# Altium schematic sheet Adapter_2023-02-26.schdoc
size 134 x 122 mm
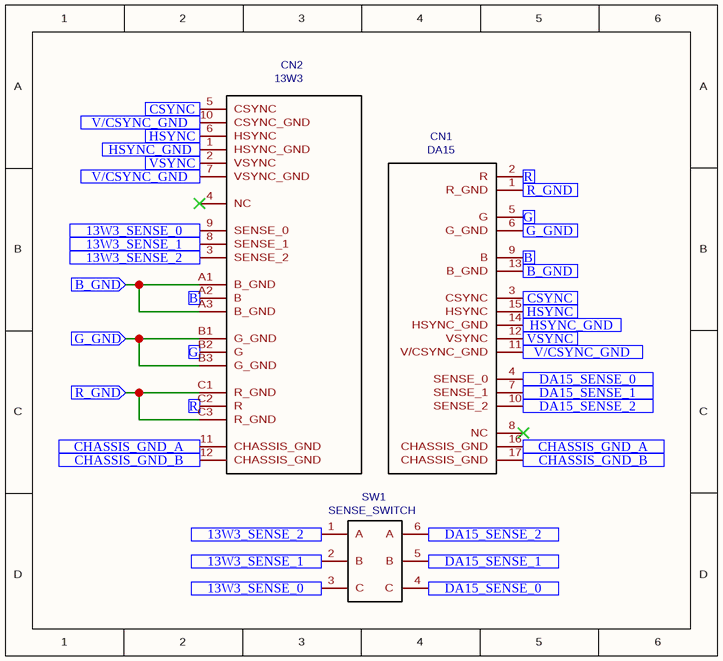
[diagram p0: Adapter_2023-02-26.schdoc]

## Parts
CN1  DA15  [DA15_RIGHT_ANGLE_PCB_MOUNT]
CN2  13W3  [13W3_RIGHT_ANGLE_PCB_MOUNT]
SW1  SENSE_SWITCH  [DIP_SWITCH_3POS]

## Ports
13W3_SENSE_0 (in), 13W3_SENSE_1 (in), 13W3_SENSE_2 (in), B (in), B_GND (in), CHASSIS_GND_A (in), CHASSIS_GND_B (in), CSYNC (in), DA15_SENSE_0 (in), DA15_SENSE_1 (in), DA15_SENSE_2 (in), G (in), G_GND (in), HSYNC (in), HSYNC_GND (in), R (in), R_GND (in), V/CSYNC_GND (in), VSYNC (in)

## Nets
13W3_SENSE_0: CN2.9(SENSE_0) SW1.3(C) ; port 13W3_SENSE_0
13W3_SENSE_1: CN2.8(SENSE_1) SW1.2(B) ; port 13W3_SENSE_1
13W3_SENSE_2: CN2.3(SENSE_2) SW1.1(A) ; port 13W3_SENSE_2
B: CN1.9(B) CN2.A2(B) ; port B
B_GND: CN1.13(B_GND) CN2.A1(B_GND) CN2.A3(B_GND) ; port B_GND
CHASSIS_GND_A: CN1.16(CHASSIS_GND) CN2.11(CHASSIS_GND) ; port CHASSIS_GND_A
CHASSIS_GND_B: CN1.17(CHASSIS_GND) CN2.12(CHASSIS_GND) ; port CHASSIS_GND_B
CSYNC: CN1.3(CSYNC) CN2.5(CSYNC) ; port CSYNC
DA15_SENSE_0: CN1.4(SENSE_0) SW1.4(C) ; port DA15_SENSE_0
DA15_SENSE_1: CN1.7(SENSE_1) SW1.5(B) ; port DA15_SENSE_1
DA15_SENSE_2: CN1.10(SENSE_2) SW1.6(A) ; port DA15_SENSE_2
G: CN1.5(G) CN2.B2(G) ; port G
G_GND: CN1.6(G_GND) CN2.B1(G_GND) CN2.B3(G_GND) ; port G_GND
HSYNC: CN1.15(HSYNC) CN2.6(HSYNC) ; port HSYNC
HSYNC_GND: CN1.14(HSYNC_GND) CN2.1(HSYNC_GND) ; port HSYNC_GND
R: CN1.2(R) CN2.C2(R) ; port R
R_GND: CN1.1(R_GND) CN2.C1(R_GND) CN2.C3(R_GND) ; port R_GND
V/CSYNC_GND: CN1.11(V/CSYNC_GND) CN2.7(VSYNC_GND) CN2.10(CSYNC_GND) ; port V/CSYNC_GND
VSYNC: CN1.12(VSYNC) CN2.2(VSYNC) ; port VSYNC

Not connected (* = marked no-connect by the designer): CN1 8(NC)*; CN2 4(NC)*

## Library data of the parts
CN1 = DA15: Contributor: will_tooker; spicePre: C; spiceSymbolName: APPLE_DA15_VIDEO_CONNECTOR_PCB_MOUNT
CN2 = 13W3: Contributor: will_tooker; spicePre: C; spiceSymbolName: 13W3_APPLE_VIDEO_RIGHT_ANGLE_PCB_MOUNT
SW1 = SENSE_SWITCH: BOM_Manufacturer: Wurth Elektronik; BOM_Manufacturer Part: 418117270903; Contributor: will_tooker; BOM_Supplier: Mouser; BOM_Supplier Part: 710-418117270903; link: https://www.mouser.com/datasheet/2/445/418117270903-3087103.pdf; spicePre: S; spiceSymbolName: DIP_SWITCH_3POS